# EAGLE schematic untitled (EAGLE 9.6.2)
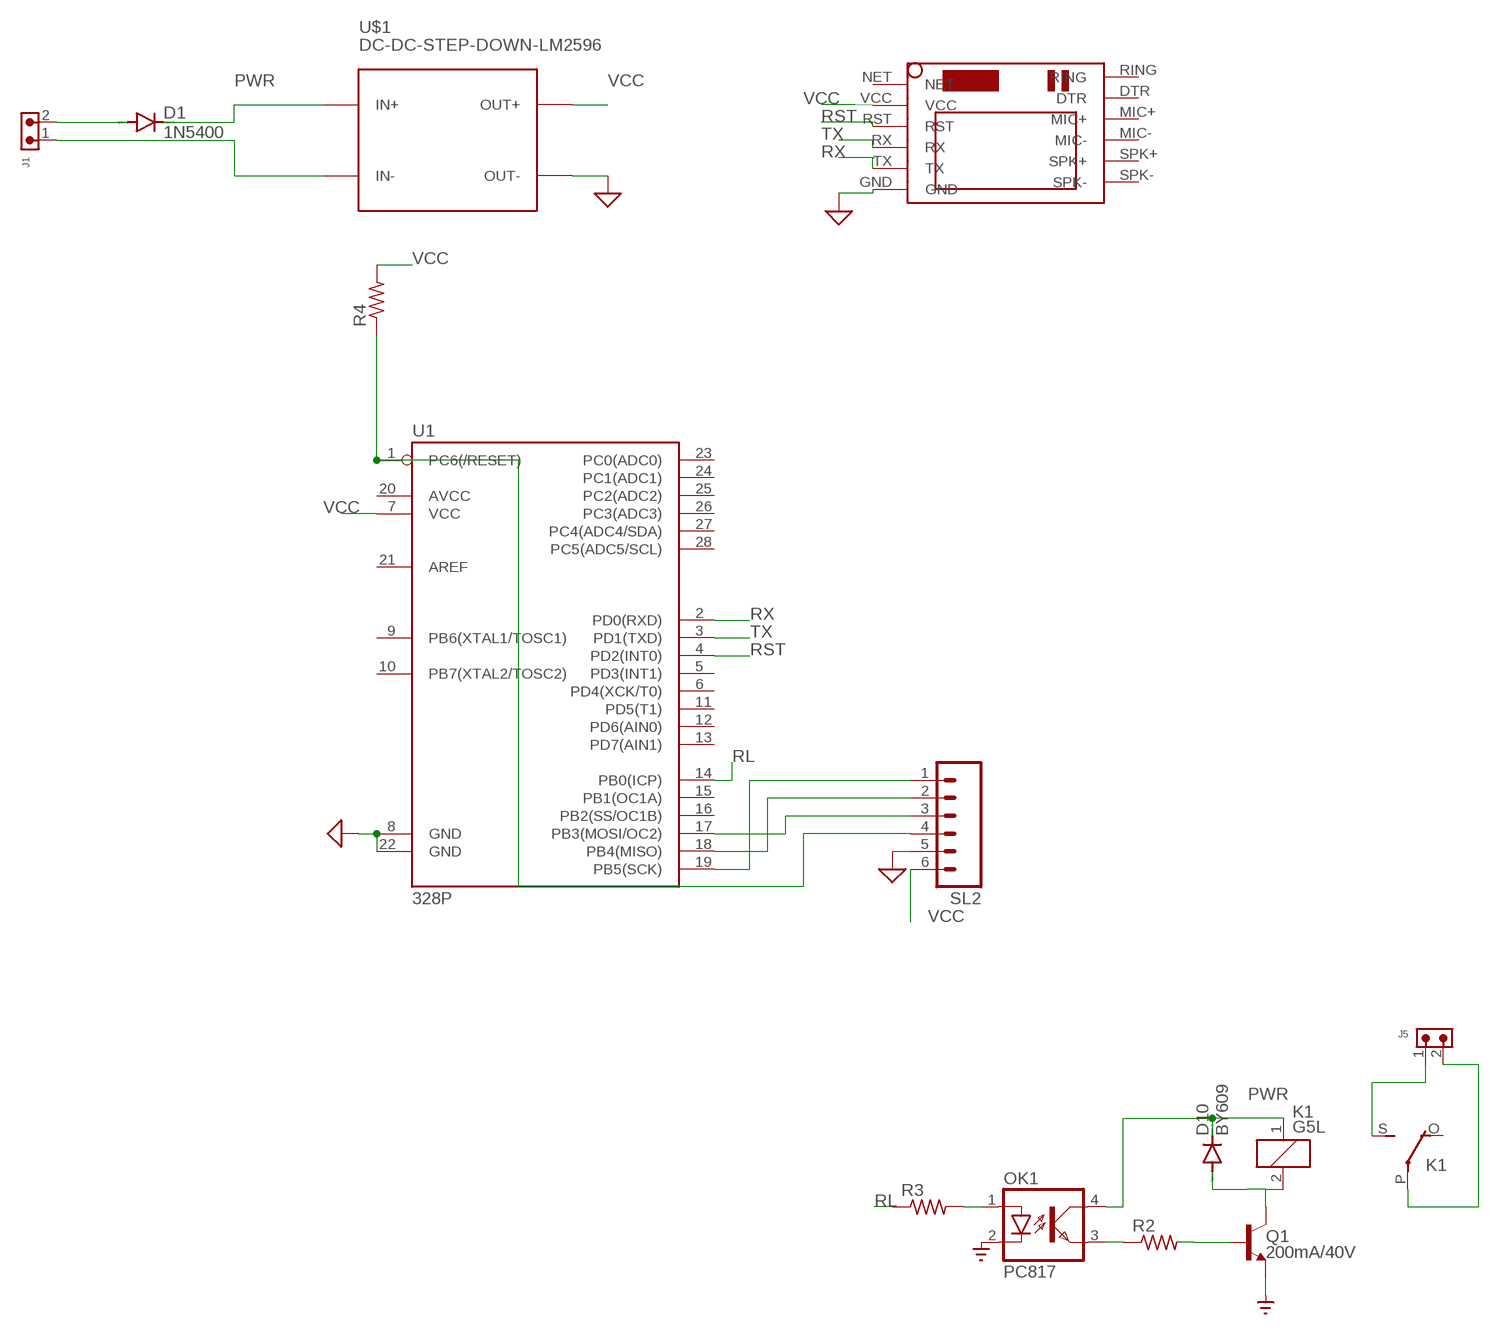
[diagram p0: schematic, sheet 1]

## Parts
D1  1N5400  [DO201-15]
D10  BY609  [SOD61B]
J1  691305530002  [691305530002]
J5  691305530002  [691305530002]
K1  G5L  [G5LE]
OK1  PC817  [DIL04]
Q1  200mA/40V  TRANS_NPN-2N3904  [TO-92]
R2  R-US_0207/10  [0207/10]
R3  R-US_0207/7  [0207/7]
R4  R-US_0207/10  [0207/10]
SL2  M06  [06P]
U1  328P  ATMEGA328P_PDIP  [DIP28]
U$1  DC-DC-STEP-DOWN-LM2596  [DC-DC-STEP-DOWN-LM2596]
U$2  SIM800LMODULE  [SIM800LMODULE]

## Nets
GND: OK1.2(C) Q1.1(E) SL2.5 U1.8(GND) U1.22(GND) U$1.OUT- U$2.GND ; supply symbol labelled SUP, SUPPLY_BRASTAN_GND_
N$1: OK1.1(A) R3.2
N$2: D1.A J1.2
N$3: J1.1 U$1.IN-
N$4: SL2.1 U1.19(PB5(SCK))
N$5: SL2.2 U1.18(PB4(MISO))
N$6: SL2.3 U1.17(PB3(MOSI/OC2))
N$9: D10.A K1.2 Q1.3(C)
N$10: J5.2 K1.P(2:P)
N$11: J5.1 K1.S(2:S)
N$12: Q1.2(B) R2.2
N$13: OK1.3(EMIT) R2.1
N$14: R4.1 SL2.4 U1.1(PC6(/RESET))
PWR: D1.C D10.C K1.1 OK1.4(COL) U$1.IN+
RL: R3.1 U1.14(PB0(ICP))
RST: U1.4(PD2(INT0)) U$2.RST
RX: U1.2(PD0(RXD)) U$2.TX
TX: U1.3(PD1(TXD)) U$2.RX
VCC: R4.2 SL2.6 U1.7(VCC) U$1.OUT+ U$2.VCC
Unconnected: K1.O(2:O) U1.5(PD3(INT1)) U1.6(PD4(XCK/T0)) U1.9(PB6(XTAL1/TOSC1)) U1.10(PB7(XTAL2/TOSC2)) U1.11(PD5(T1)) U1.12(PD6(AIN0)) U1.13(PD7(AIN1)) U1.15(PB1(OC1A)) U1.16(PB2(SS/OC1B)) U1.20(AVCC) U1.21(AREF) U1.23(PC0(ADC0)) U1.24(PC1(ADC1)) U1.25(PC2(ADC2)) U1.26(PC3(ADC3)) U1.27(PC4(ADC4/SDA)) U1.28(PC5(ADC5/SCL)) U$2.DTR U$2.MIC+ U$2.MIC- U$2.NET U$2.RING U$2.SPK+ U$2.SPK-

## Library data of the parts
D1 = diode:1N5400: DIODE standard rectifier, 3 A, 50 V (Motorola)
D10 = diode:BY609: DIODE
J1 J5 = Wurth_Connectors_WR-TBL Pluggable Connector:691305530002: WR-TBL Serie 3055 - 5,08 mm - PCB Header Vertical Entry with Plastic Latches KIND PROPERTIES Pitch 5.08 mm MATERIAL PROPERTIES Insulator Material PA66 Insulator Flammability Rating UL94 V-0 Insulator Color Green Terminal Material Copper Alloy Terminal Plating Tin-plated surface GENERAL INFORMATION Operating Temperature -40 up to +105 °C ELECTRICAL PROPERTIES IR UL 16 A Working Voltage [UL] 300 V (AC) Withstanding Voltage [UL] 2500 V (AC) Contact Resistance [UL] 20 mΩ CERTIFICATION UL Approval E315414 <https://www.we-online.com/catalog/media/o135349v209%20Family_WR-TBL3_6913055300xx.jpg> Details see: https://www.we-online.com/catalog/en/TBL_5_08_3055_6913055300XX/ Updated by Ella Wu 2019-12-30 2019(C) Wurth Elektronik; DATASHEET-URL: https://www.we-online.com/catalog/datasheet/691305530002.pdf; IR-UL: 16A; MOUNT: THT; PART-NUMBER: 691305530002; PINS: 2; PITCH: 5.08mm; TYPE: Vertical; WORKING-VOLTAGE-UL: 300V (AC)
K1 = relay:G5L: RELAY 1 x switch, 10 A/120 V AC, 8 A/30 V ADC, Omron; OC_FARNELL: unknown; OC_NEWARK: unknown
OK1 = optocoupler:PC817: SHARP OPTO COUPLER; MPN: PC817X4J000F; OC_FARNELL: 9707727; OC_NEWARK: 97K7059
Q1 = SparkFun-DiscreteSemi:TRANS_NPN: NPN transistor Current controlled devices typically used to amplify current or used as a switch. BC547 - COM-08928 <http://www.sparkfun.com/products/8928> (TO-92 45V 100mA) (1.Collector 2.Base 3.Emitter) 2N3904 - COM-00521 <http://www.sparkfun.com/products/521> (TO-92 40V 200mA) (1.Emitter 2.Base 3.Collector) P2N2222A - COM-12852 <http://www.sparkfun.com/products/12852> (TO-92 40V 600mA) (1.Collector 2.Base 3.Emitter); PROD_ID: TRANS-08447
R2 R4 = BeagleBone_Black_Wireless:R-US_: RESISTOR, American symbol
R3 = adafruit:R-US_: RESISTOR, American symbol
SL2 = con-amp-quick:M06: AMP QUICK CONNECTOR; OC_FARNELL: unknown; OC_NEWARK: unknown
U1 = SparkFun-IC-Microcontroller:ATMEGA328P_PDIP: Atmel 328P Through hole ATMEGA328P uC used in the Arduino 32kb flash, 1k EEPROM, 2k SRAM Datasheet <http://www.sparkfun.com/datasheets/Components/SMD/ATMega328.pdf> SparkFun Products Storefront component: AVR 28 Pin 20MHz 32K 6A/D - ATMega328P <https://www.sparkfun.com/products/9061> (COM-09061) SparkFun Simon Says - Through-Hole Soldering Kit <https://www.sparkfun.com/products/10547> (KIT-10547) SparkFun Learn to Solder - Simon Says <https://www.sparkfun.com/products/13708> (KIT-13708) SparkFun BigTime Watch Kit <https://www.sparkfun.com/products/11734> (KIT-11734) SparkFun ClockIt <https://www.sparkfun.com/products/10930> (KIT-10930) SparkFun Serial Enabled LCD Kit <https://www.sparkfun.com/products/10097> (LCD-10097) SparkFun Simon Tilts - Through Hole Soldering Kit <https://www.sparkfun.com/products/12634> (KIT-12634) SparkFun Frequency Counter Kit <https://www.sparkfun.com/products/10140> (KIT-10140) FabFM Radio Kit <https://www.sparkfun.com/products/11043> (KIT-11043) SparkFun Binary Blaster Kit <https://www.sparkfun.com/products/12037> (KIT-12037) SparkFun Metro-Gnome <https://www.sparkfun.com/products/9236> (KIT-09236) ATmega328 with Arduino Optiboot (Uno) <https://www.sparkfun.com/products/10524> (DEV-10524); PROD_ID: IC-09136
U$1 = diy-modules:DC-DC-STEP-DOWN-LM2596: DC/DC Step-Down Regulator based on LM2596-ADJ chip LM2596 datasheet available here: http://www.ti.com/lit/ds/symlink/lm2596.pdf Click here to find device on ebay.com <http://www.ebay.com/sch/lm2596+power+regulator>
U$2 = SIM800LMODULE:SIM800LMODULE: SIM800L Module